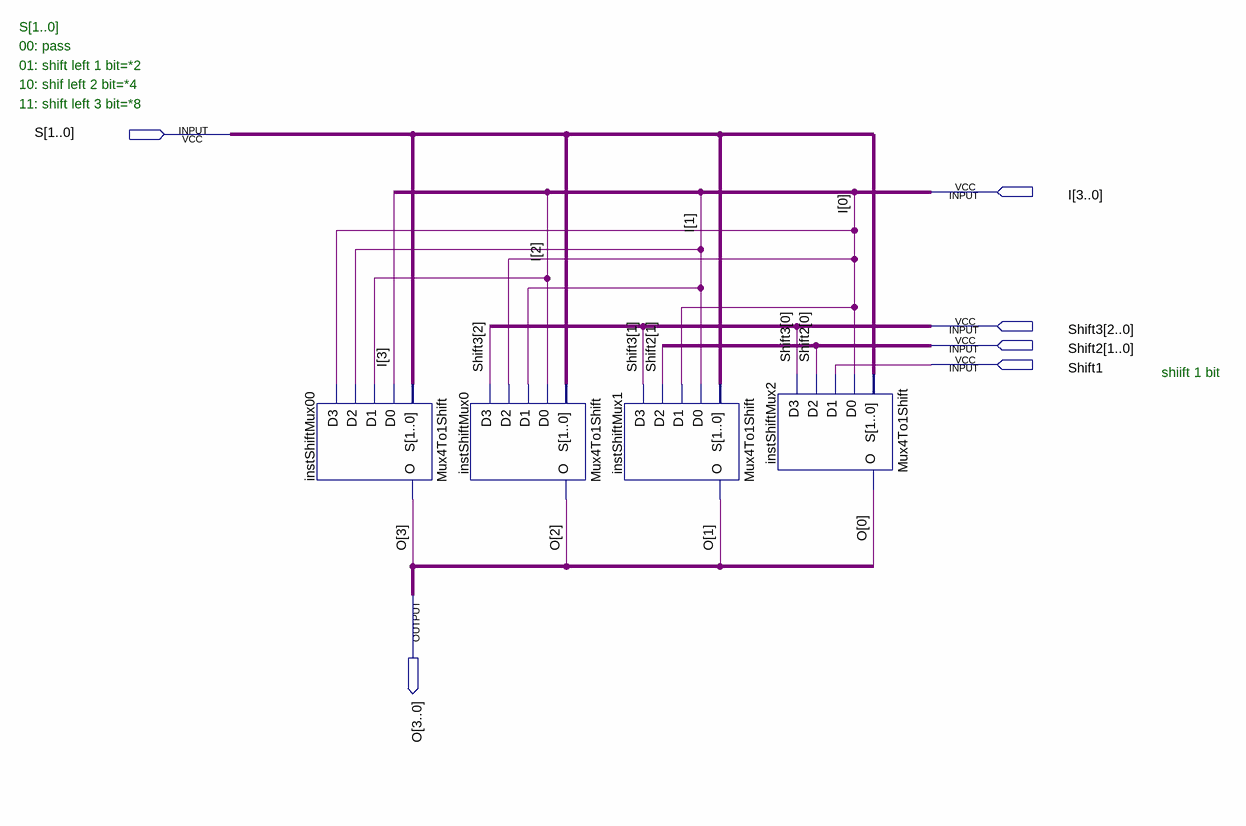
[diagram p0: schematic sheet]
// Quartus schematic ShiftLeft4bit.bdf as structural Verilog: 4 symbols, 6 pins
module ShiftLeft4bit (
  input  [1:0] S,
  input  [3:0] I,
  input  [2:0] Shift3,
  input  [1:0] Shift2,
  input  Shift1,
  output [3:0] O
);

  Mux4To1Shift instShiftMux00 (.S(S), .D0(I[3]), .D1(I[2]), .D2(I[1]), .D3(I[0]), .O(O[3]));
  Mux4To1Shift instShiftMux0 (.S(S), .D0(I[2]), .D1(I[1]), .D2(I[0]), .D3(Shift3[2]), .O(O[2]));
  Mux4To1Shift instShiftMux1 (.S(S), .D0(I[1]), .D1(I[0]), .D2(Shift2[1]), .D3(Shift3[1]), .O(O[1]));
  Mux4To1Shift instShiftMux2 (.S(S), .D0(I[0]), .D1(Shift1), .D2(Shift2[0]), .D3(Shift3[0]), .O(O[0]));

  // Notes on the sheet:
  //   S[1..0]
  //   00: pass
  //   01: shift left 1 bit=*2
  //   10: shif left 2 bit=*4
  //   11: shift left 3 bit=*8
  //   shiift 1 bit
endmodule
